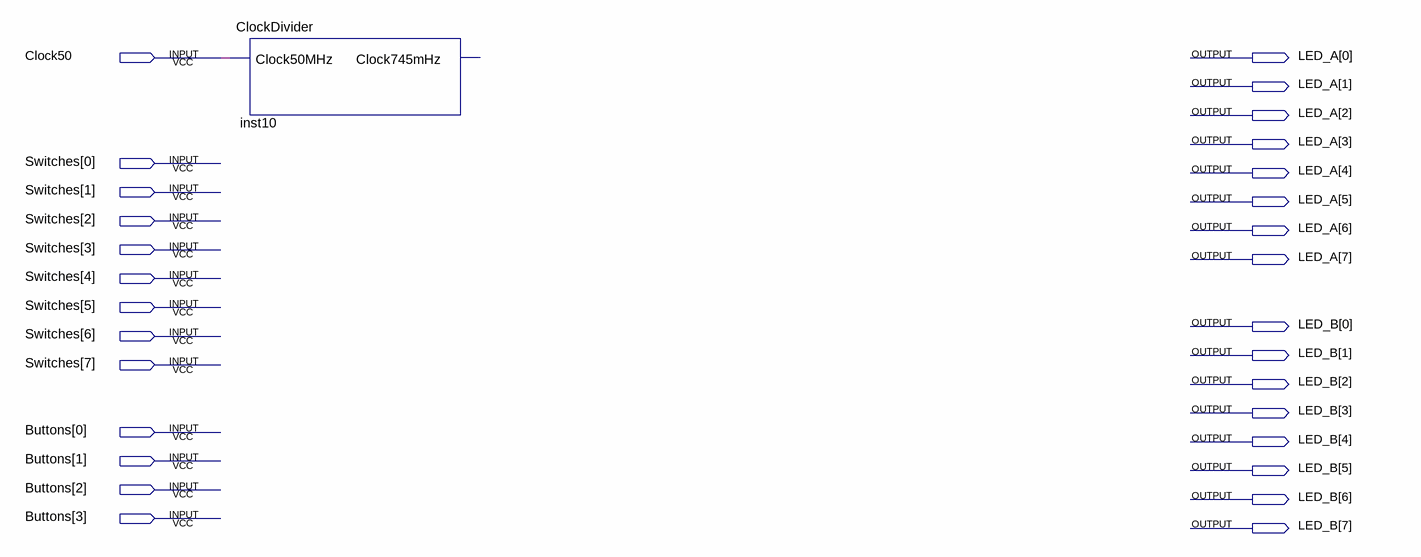
[diagram p0: schematic sheet]
// Quartus schematic template.bdf as structural Verilog: 1 symbols, 29 pins
module template (
  input  Clock50,
  input  [7:0] Switches,
  input  [3:0] Buttons,
  output [7:0] LED_A,
  output [7:0] LED_B
);

  ClockDivider inst10 (.Clock50MHz(Clock50));  // open: Clock745mHz
endmodule
